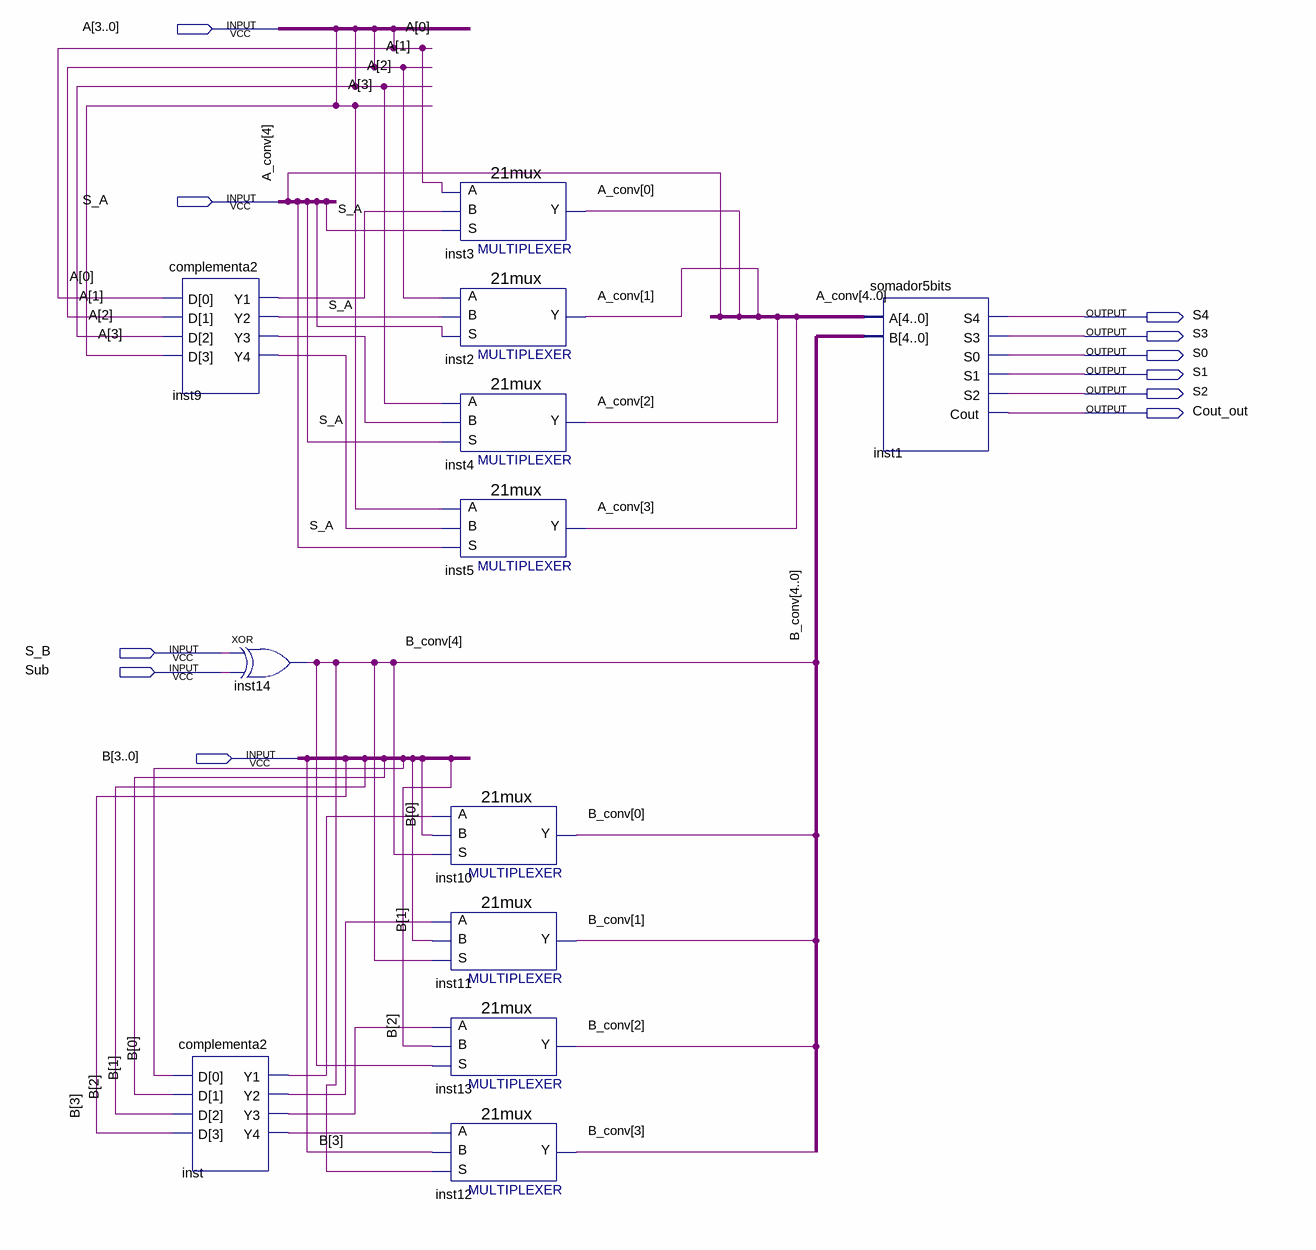
[diagram p0: schematic sheet]
// Quartus schematic somadorsubtrator.bdf as structural Verilog: 12 symbols, 11 pins
module somadorsubtrator (
  input  [3:0] A,
  input  S_A,
  input  S_B,
  input  Sub,
  input  [3:0] B,
  output S4,
  output S3,
  output S0,
  output S1,
  output S2,
  output Cout_out
);

  wire inst9_y1, inst9_y2, inst9_y3, inst9_y4, inst_y1, inst_y2, inst_y3, inst_y4;
  wire [4:0] A_conv, B_conv;

  complementa2 inst9 (.D(A), .Y1(inst9_y1), .Y2(inst9_y2), .Y3(inst9_y3), .Y4(inst9_y4));
  complementa2 inst (.D(B), .Y1(inst_y1), .Y2(inst_y2), .Y3(inst_y3), .Y4(inst_y4));
  xor inst14 (B_conv[4], S_B, Sub);
  \21mux  inst3 (.S(S_A), .B(inst9_y1), .A(A[0]), .Y(A_conv[0]));
  \21mux  inst2 (.S(S_A), .B(inst9_y2), .A(A[1]), .Y(A_conv[1]));
  \21mux  inst4 (.S(S_A), .B(inst9_y3), .A(A[2]), .Y(A_conv[2]));
  \21mux  inst5 (.S(S_A), .B(inst9_y4), .A(A[3]), .Y(A_conv[3]));
  \21mux  inst10 (.S(B_conv[4]), .B(B[0]), .A(inst_y1), .Y(B_conv[0]));
  \21mux  inst11 (.S(B_conv[4]), .B(B[1]), .A(inst_y2), .Y(B_conv[1]));
  \21mux  inst13 (.S(B_conv[4]), .B(B[2]), .A(inst_y3), .Y(B_conv[2]));
  \21mux  inst12 (.S(B_conv[4]), .B(B[3]), .A(inst_y4), .Y(B_conv[3]));
  somador5bits inst1 (.A(A_conv), .B(B_conv), .S4(S4), .S3(S3), .S0(S0), .S1(S1), .S2(S2), .Cout(Cout_out));
endmodule
